# EAGLE design Radial-V Alim (EAGLE 7.4.0)
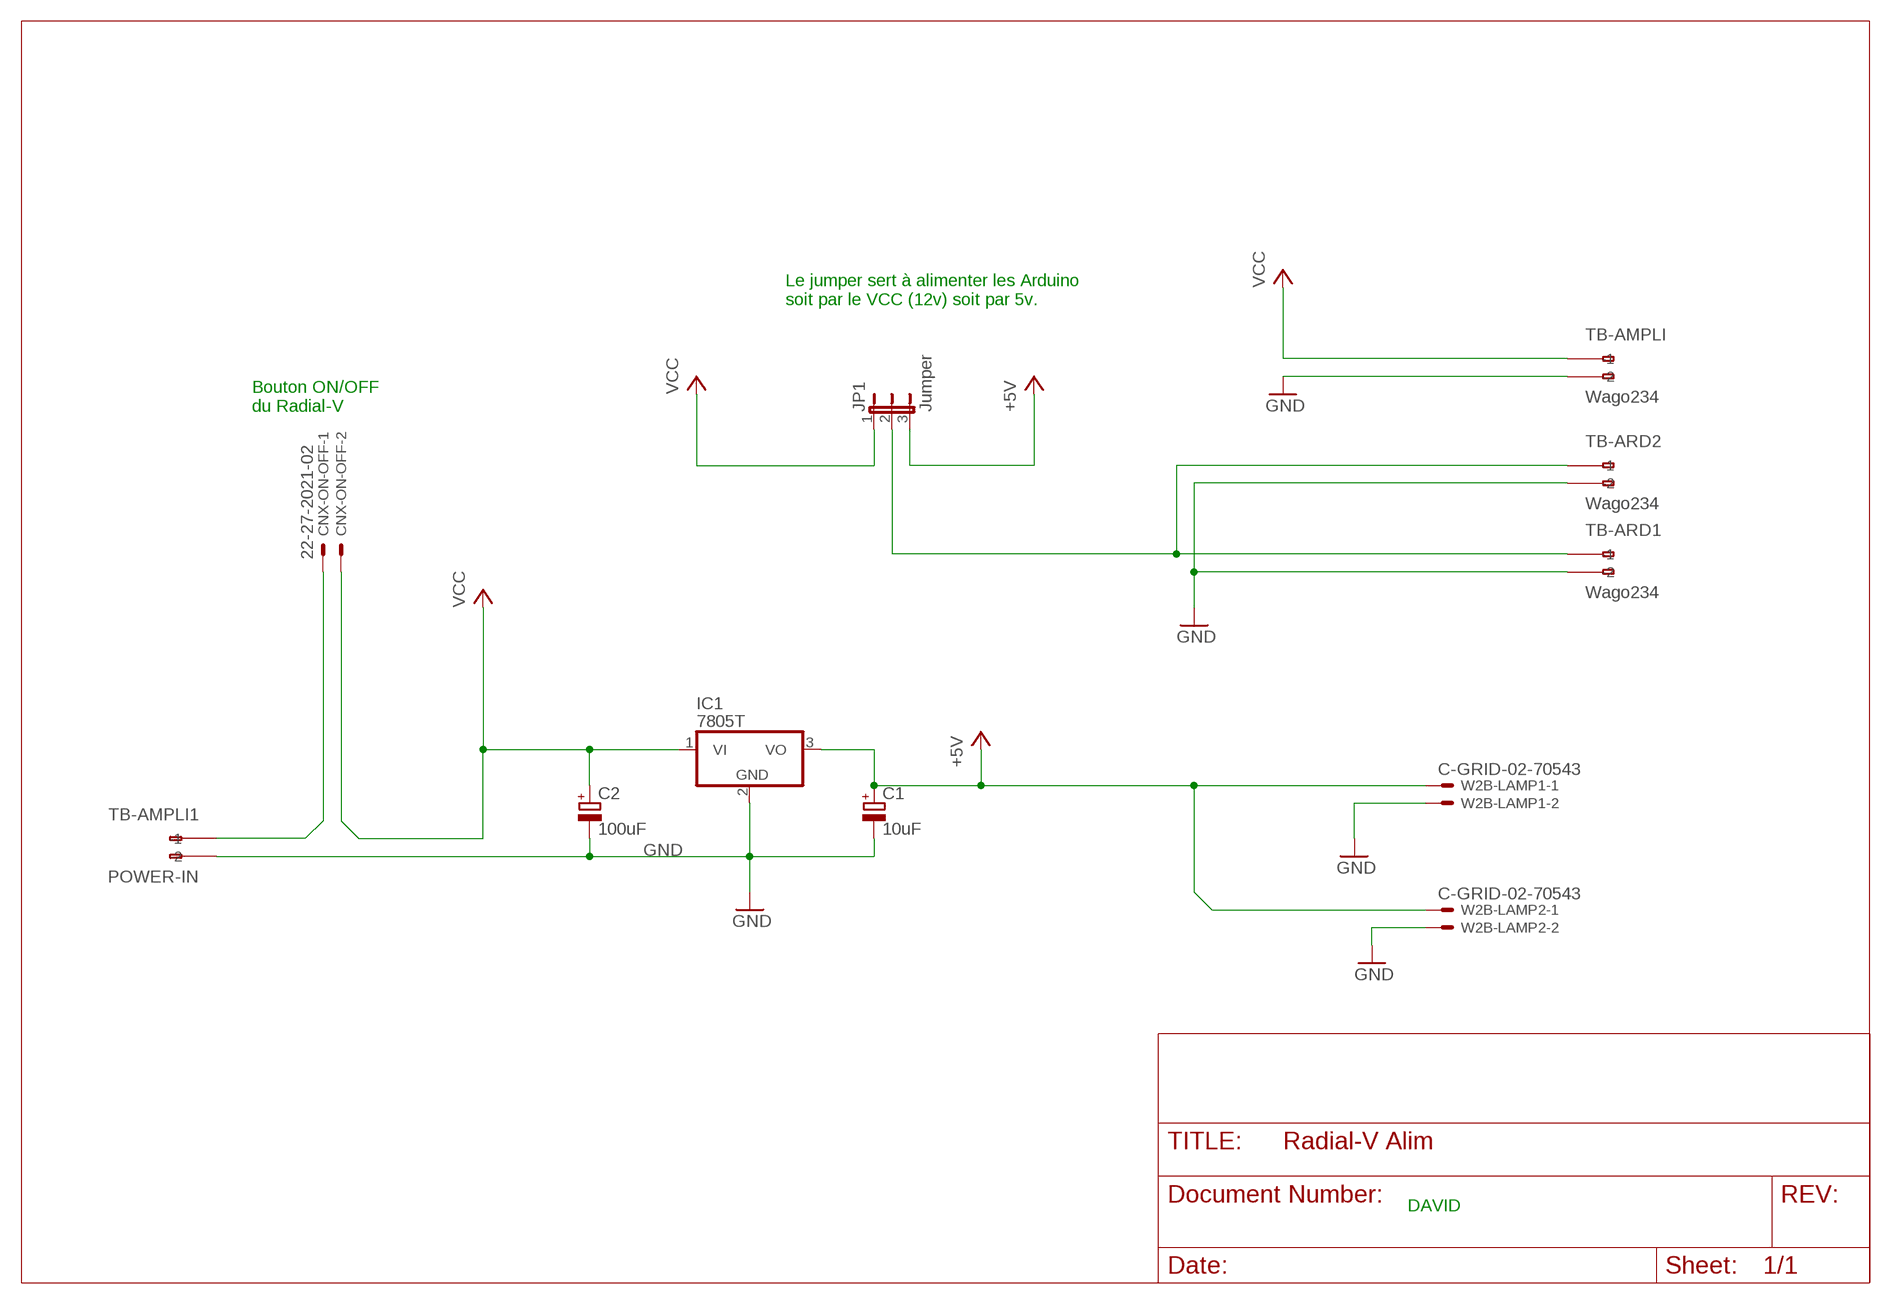
[diagram p0: schematic, sheet 1]

## Parts
C1  10uF  CPOL-EUE5-5  [E5-5]
C2  100uF  CPOL-EUE22-10AXIAL  [E22-10]
CNX-ON-OFF  22-27-2021-02  [6410-02]
IC1  7805T  [TO220H]
JP1  Jumper  JP2E  [JP2]
TB-AMPLI  Wago234  234-202  [234-202]
TB-AMPLI1  POWER-IN  234-202  [234-202]
TB-ARD1  Wago234  234-202  [234-202]
TB-ARD2  Wago234  234-202  [234-202]
W2B-LAMP1  C-GRID-02-70543  [70543-02]
W2B-LAMP2  C-GRID-02-70543  [70543-02]

## Nets
+5V: C1.+ IC1.3(VO) JP1.3 W2B-LAMP1.1 W2B-LAMP2.1
GND: C1.- C2.- IC1.2(GND) TB-AMPLI1.A2(-2) TB-AMPLI.A2(-2) TB-ARD1.A2(-2) TB-ARD2.A2(-2) W2B-LAMP1.2 W2B-LAMP2.2
N$1: JP1.2 TB-ARD1.A1(-1) TB-ARD2.A1(-1)
N$25: CNX-ON-OFF.1 TB-AMPLI1.A1(-1)
VCC: C2.+ CNX-ON-OFF.2 IC1.1(VI) JP1.1 TB-AMPLI.A1(-1)
Unconnected: TB-AMPLI1.B1(B-1) TB-AMPLI1.B2(B-2) TB-AMPLI.B1(B-1) TB-AMPLI.B2(B-2) TB-ARD1.B1(B-1) TB-ARD1.B2(B-2) TB-ARD2.B1(B-1) TB-ARD2.B2(B-2)

## Notes on the sheet
- Le jumper sert à alimenter les Arduino 
  soit par le VCC (12v) soit par 5v.
- Bouton ON/OFF
  du Radial-V
- DAVID

## Library data of the parts
C1 C2 = resistor:CPOL-EU: POLARIZED CAPACITOR, European symbol
CNX-ON-OFF = con-molex:22-?-02: CONNECTOR wire to board 2.54 mm (.1 inch) pitch header; OC_FARNELL: unknown; OC_NEWARK: unknown
IC1 = linear:78*: Positive VOLTAGE REGULATOR Source: http://cache.national.com/ds/LM/LM78L05.pdf http://www.fairchildsemi.com/ds/LM/LM7805.pdf
JP1 = jumper:JP2E: JUMPER
TB-AMPLI TB-AMPLI1 TB-ARD1 TB-ARD2 = con-wago255:234-202: WAGO; MPN: 234-202; OC_FARNELL: unknown; OC_NEWARK: 28K9091
W2B-LAMP1 W2B-LAMP2 = con-molex:C-GRID-02: CONNECTOR wire to board 2.54 mm (0.100") pitch header; OC_FARNELL: unknown; OC_NEWARK: unknown

## Board
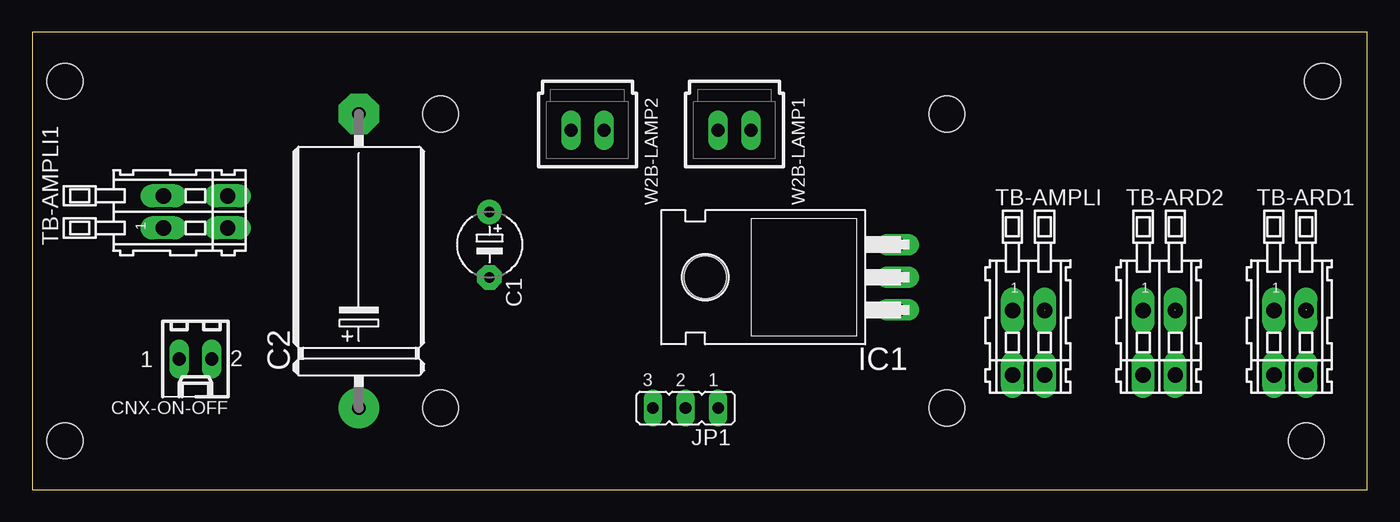
[diagram p1: board, top side]
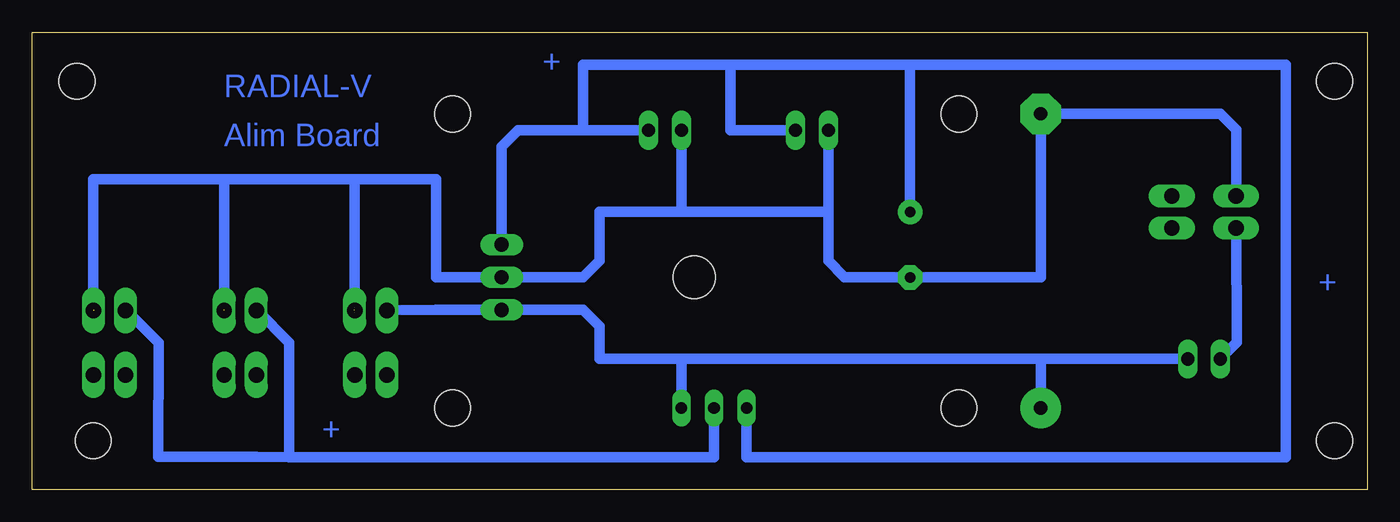
[diagram p2: board, bottom side, seen from below]

Size 103.81 x 35.56 mm. Coordinates in mm from the lower left corner, seen from the top.
Outline: 0,0 103.81,0 103.81,35.55 87.63,35.56 76.2,35.56 76.2,35.55 71.12,35.56 0,35.55 0,0
Copper layers (1*16): Top 0.035mm / dielectric 1.5mm / Bottom 0.035mm
Design rules "default": minimum track width 10mil, minimum drill 24mil, track to track 8mil, track to pad 8mil, pad to pad 8mil, via to via 8mil, smd to smd 8mil, copper to edge 40mil, drill to drill 8mil, minimum pad ring 10mil, minimum via ring 8mil, stop-mask expansion 4mil, vias tented up to drill 0mil, thermal gap 10mil
Holes 2.8 mm at 99.06,3.81 71.12,29.21 31.75,6.35 31.75,29.21 71.12,6.35 100.33,31.75 2.54,31.75 2.54,3.81

### Footprints (pad centres in the part's own frame; a part is rotated, then mirrored left to right if it is on the bottom)
E5-5 = drill 0.813 pad 1.905: + -2.54,0 | drill 0.813 pad 1.905 octagon: - 2.54,0
E22-10 = drill 1.016 pad 3.15: + -11.43,0 | drill 1.016 pad 3.15 octagon: - 11.43,0
6410-02 = drill 1.016 long: 1 1.27,0; 2 -1.27,0
TO220H = drill 1.118 long: 1 -2.54,-10.16; 2 0,-10.16; 3 2.54,-10.16 | hole 3.302: 0,4.826
JP2 = drill 0.914 long: 1 -2.54,0; 2 0,0; 3 2.54,0
234-202 = drill 1.2 long: A1 -1.25,2.5; A2 1.25,2.5; B1 -1.25,-2.5; B2 1.25,-2.5
70543-02 = drill 1.016 long: 1 -1.27,0; 2 1.27,0

### Placement (x,y rotation side)
C1  35.56,19.05 270 top
C2  25.4,17.78 90 top
CNX-ON-OFF  12.7,10.16 180 top
IC1  57.15,16.51 90 top
JP1  50.8,6.35 180 top
TB-AMPLI  77.47,11.43 0 top
TB-AMPLI1  12.7,21.59 90 top
TB-ARD1  97.79,11.43 0 top
TB-ARD2  87.63,11.43 0 top
W2B-LAMP1  54.61,27.94 180 top
W2B-LAMP2  43.18,27.94 180 top

### Tracks (layer width: path | path; a pad name or v marks a point on that pad's centre or on a via)
+5V
  Bottom 0.813: W2B-LAMP1.1 60.96,27.94 | 60.96,27.94 66.04,27.94 67.31,26.67 IC1.3 | C1.+ 35.56,33.02 | 49.53,33.02 60.96,33.02 60.96,27.94 | 49.53,33.02 35.56,33.02 | JP1.3 48.26,2.54 6.35,2.54 6.35,33.02 35.56,33.02 | W2B-LAMP2.1 49.53,27.94 49.53,33.02
GND  (3 unrouted)
  Bottom 0.813: 78.74,24.13 72.39,24.13 72.39,16.51 IC1.2 60.96,16.51 59.69,17.78 59.69,21.59 53.34,21.59 | 78.74,24.13 88.9,24.13 | 88.9,24.13 99.06,24.13 99.06,13.97 | 88.9,13.97 88.9,24.13 | 41.91,21.59 41.91,17.78 40.64,16.51 C1.- 25.4,16.51 C2.- 11.43,29.21 10.2,27.98 TB-AMPLI1.A2 | 41.91,21.59 W2B-LAMP2.2 | W2B-LAMP1.2 53.34,21.59 | 53.34,21.59 41.91,21.59 | 78.74,13.97 78.74,24.13
N$1
  Bottom 0.813: JP1.2 50.8,2.54 83.82,2.54 | TB-ARD1.A1 96.48,13.93 93.98,11.43 94,2.56 86.38,2.56 83.82,2.54 | TB-ARD2.A1 86.32,13.93 83.82,11.43 83.84,3.83 83.82,2.54
N$25
  Bottom 0.813: TB-AMPLI1.A1 10.16,11.45 CNX-ON-OFF.1
VCC
  Bottom 0.813: 53.34,10.16 59.69,10.16 59.69,12.7 60.96,13.97 IC1.1 72.39,13.97 72.41,13.99 76.16,13.93 TB-AMPLI.A1 | 53.34,10.16 JP1.1 | CNX-ON-OFF.2 25.4,10.16 | 25.4,10.16 53.34,10.16 | C2.+ 25.4,10.16

### Text on the board
Bottom: + | RADIAL-V | Alim Board | + | +